# Altium project Test board - MBED.PrjPcb
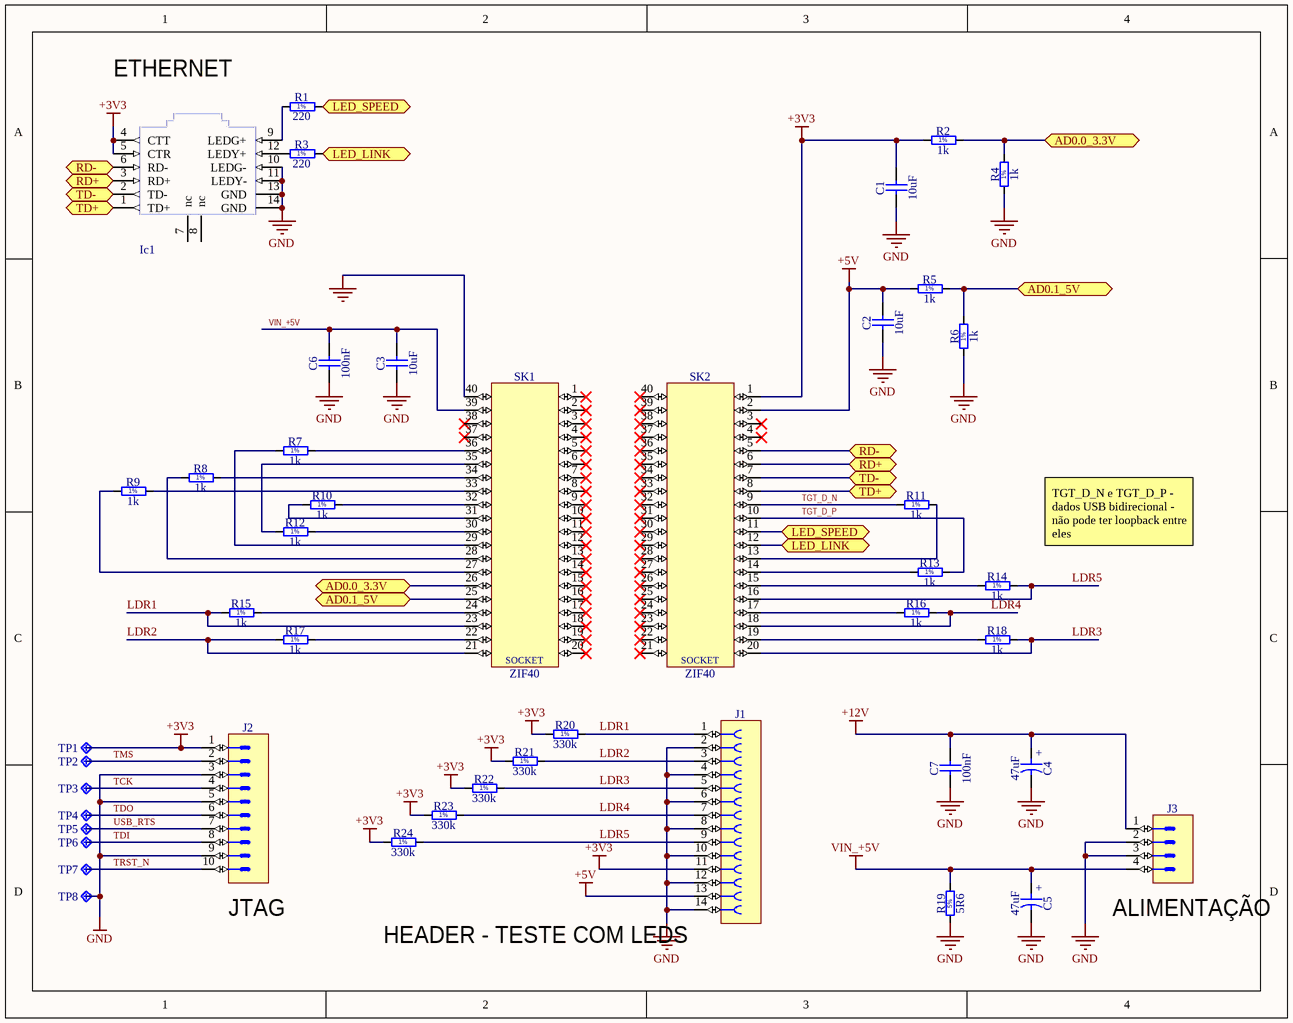
[diagram p0: test_board.schdoc]
1 sheet, 45 parts. Net scope: flat (ports and power ports of the same name join across sheets).
Board file: test_board.PcbDoc

## Sheet test_board.schdoc: AT long bus (13.3 x 4.2 inches)
size A; Organization: Organization; Address1: Address1; Address2: Address2; Address3: Address3; Address4: Address4; DocumentNumber: 1; Revision: 0; SheetNumber: 2; SheetTotal: 2

### Parts
C1  10uF  [CAPC2012X135N]
C2  10uF  [CAPC2012X135N]
C3  10uF  [CAPC2012X135N]
C4  47uF  [CAPMP3528X210N]
C5  47uF  [CAPMP3528X210N]
C6  100nF  [CAPC2012X135N]
C7  100nF  [CAPC2012X135N]
Ic1  RJ45  [J0006D21BNL]  (value not drawn)
J1  Socket 14  [SAMTEC_SSW-107-01-G-D]  (value not drawn)
J2  Header 10  [SAMTEC_FTSH-105-01-L-DV]  (value not drawn)
J3  KK®  [MOLEX_22-27-2041]  (value not drawn)
R1  220  [RESC2012X60N]
R2  1k  [RESC2012X60N]
R3  220  [RESC2012X60N]
R4  1k  [RESC2012X60N]
R5  1k  [RESC2012X60N]
R6  1k  [RESC2012X60N]
R7  1k  [RESC2012X60N]
R8  1k  [RESC2012X60N]
R9  1k  [RESC2012X60N]
R10  1k  [RESC2012X60N]
R11  1k  [RESC2012X60N]
R12  1k  [RESC2012X60N]
R13  1k  [RESC2012X60N]
R14  1k  [RESC2012X60N]
R15  1k  [RESC2012X60N]
R16  1k  [RESC2012X60N]
R17  1k  [RESC2012X60N]
R18  1k  [RESC2012X60N]
R19  5R6  [RES_WELWYN_W22]
R20  330k  [RESC2012X60N]
R21  330k  [RESC2012X60N]
R22  330k  [RESC2012X60N]
R23  330k  [RESC2012X60N]
R24  330k  [RESC2012X60N]
SK1  ZIF40  [DIPS_ZIF40]
SK2  ZIF40  [DIPS_ZIF40]
TP1  (no value)  [P25-3226]
TP2  (no value)  [P25-3226]
TP3  (no value)  [P25-3226]
TP4  (no value)  [P25-3226]
TP5  (no value)  [P25-3226]
TP6  (no value)  [P25-3226]
TP7  (no value)  [P25-3226]
TP8  (no value)  [P25-3226]

### Ports
AD0.0_3.3V, AD0.1_5V, LED_LINK, LED_SPEED, RD+, RD-, TD+, TD-

### Nets
+3V3: C1.2 Ic1.4(CTT) Ic1.5(CTR) J1.11 J2.1 R2.1 R20.1 R21.1 R22.1 R23.1 R24.1 SK2.1 TP1.H1
+5V: C2.2 J1.13 R5.1 SK2.2
+12V: C4.1 C7.2 J3.1
GND: C1.1 C2.1 C3.1 C4.2 C5.2 C6.1 C7.1 Ic1.10(LEDG-) Ic1.11(LEDY-) Ic1.13(GND) Ic1.14(GND) J1.2 J1.4 J1.6 J1.8 J1.10 J1.12 J1.14 J2.3 J2.5 J2.9 J3.2 J3.3 R4.1 R6.1 R19.1 SK1.40 TP8.H1
VIN_+5V: C3.2 C5.1 C6.2 J3.4 R19.2 SK1.39
LDR1: J1.1 R15.1 R20.2 SK1.23
LDR2: J1.3 R17.1 R21.2 SK1.21
LDR3: J1.5 R18.2 R22.2 SK2.20
LDR4: J1.7 R16.2 R23.2 SK2.18
LDR5: J1.9 R14.2 R24.2 SK2.16
TCK: J2.4 TP3.H1
TDI: J2.8 TP6.H1
TDO: J2.6 TP4.H1
TGT_D_N: R11.1 SK2.9
TGT_D_P: R13.2 SK2.10
TMS: J2.2 TP2.H1
TRST_N: J2.10 TP7.H1
USB_RTS: J2.7 TP5.H1
NetIc1_1: Ic1.1(TD+) SK2.8 ; port TD+
NetIc1_2: Ic1.2(TD-) SK2.7 ; port TD-
NetIc1_3: Ic1.3(RD+) SK2.6 ; port RD+
NetIc1_6: Ic1.6(RD-) SK2.5 ; port RD-
NetIc1_9: Ic1.9(LEDG+) R1.1
NetIc1_12: Ic1.12(LEDY+) R3.1
NetR1_2: R1.2 SK2.11 ; port LED_SPEED
NetR2_2: R2.2 R4.2 SK1.26 ; port AD0.0_3.3V
NetR3_2: R3.2 SK2.12 ; port LED_LINK
NetR5_2: R5.2 R6.2 SK1.25 ; port AD0.1_5V
NetR7_1: R7.1 SK1.29
NetR7_2: R7.2 SK1.36
NetR8_1: R8.1 SK1.28
NetR8_2: R8.2 SK1.34
NetR9_1: R9.1 SK1.27
NetR9_2: R9.2 SK1.33
NetR10_1: R10.1 SK1.31
NetR10_2: R10.2 SK1.32
NetR11_2: R11.2 SK2.13
NetR12_1: R12.1 SK1.35
NetR12_2: R12.2 SK1.30
NetR13_1: R13.1 SK2.14
NetR14_1: R14.1 SK2.15
NetR15_2: R15.2 SK1.24
NetR16_1: R16.1 SK2.17
NetR17_2: R17.2 SK1.22
NetR18_1: R18.1 SK2.19

Not connected (* = marked no-connect by the designer): Ic1 7(nc) 8(nc); SK1 1* 2* 3* 4* 5* 6* 7* 8* 9* 10* 11* 12* 13* 14* 15* 16* 17* 18* 19* 20* 37* 38*; SK2 3* 4* 21* 22* 23* 24* 25* 26* 27* 28* 29* 30* 31* 32* 33* 34* 35* 36* 37* 38* 39* 40*

### Notes on the sheet
- ETHERNET
- (near R14) TGT_D_N e TGT_D_P - dados USB bidirecional - não pode ter loopback entre eles
- (near J2) JTAG
- HEADER - TESTE COM LEDS
- (near J3) ALIMENTAÇÃO
- (in symbol 240-1280-00-0602J) SOCKET
- (in symbol CTE3528-21_47UF_6.3V_10%_LESR0250) +
- (in symbol R0805_1K_1%_0.125W_100PPM) 1%
- (in symbol R0805_220R_1%_0.125W_100PPM) 1%
- (in symbol R0805_330K_1%_0.125W_100PPM) 1%
- (in symbol RWW_5R6_5%_7W_75PPM_WELWYN_W22) 5%

### Library data of the parts
C1-C3 = CC0805_10UF_10V_10%_X7R: Non-polarised capacitor; Part Description: SMD Multilayer Chip Ceramic Capacitor; Manufacturer: GENERIC; Manufacturer1 Part Number: GRM21BR71A106KE51L; Voltage: 10V; TC: X7R; Tolerance: ±10%; Part Number: CC0805_10UF_10V_10%_X7R; Component Kind: Standard; Component Type: Standard; Pin Count: 2; Value: 10uF; Status: Preferred; Manufacturer Part Number: CC0805_10UF_10V_10%_X7R; Case: 0805; Mounted: Yes; Socket: No; SMD: Yes; Sense: No; Manufacturer1 Example: MURATA; Manufacturer1 ComponentHeight: 1.35mm; HelpURL: \\cern.ch\dfs\Applications\Altium\Datasheets\CC0805_X7R_MURATA.pdf; Author: CERN DEM JLC; CreateDate: 30/04/2012; LatestRevisionDate: 30/04/2012
C4 C5 = CTE3528-21_47UF_6.3V_10%_LESR0250: Polarised capacitor; Part Description: Low ESR 0R25 Solid Tantalum Chip Capacitor; Manufacturer: GENERIC; Manufacturer1 Part Number: TPSB476K006R0250; Voltage: 6.3V; Tolerance: ±10%; Part Number: CTE3528-21_47UF_6.3V_10%_LESR0250; Component Kind: Standard; Component Type: Standard; Pin Count: 2; Value: 47uF; Status: Preferred; Manufacturer Part Number: CTE3528-21_47UF_6.3V_10%_LESR0250; Case: B; Mounted: Yes; Socket: No; SMD: Yes; Sense: No; Manufacturer1 Example: AVX; Manufacturer1 ComponentHeight: 2.1mm; HelpURL: \\cern.ch\dfs\Applications\Altium\Datasheets\CTE-LESR_AVX_TPS.pdf; Author: CERN DEM JLC; CreateDate: 05/05/2008; LatestRevisionDate: 20/01/2009
C6 C7 = CC0805_100NF_50V_10%_X7R: Non-polarised capacitor; Part Description: SMD Multilayer Chip Ceramic Capacitor; Manufacturer: GENERIC; Manufacturer1 Part Number: C2012X7R1H104K085AA; Voltage: 50V; TC: X7R; Tolerance: ±10%; Part Number: CC0805_100NF_50V_10%_X7R; Component Kind: Standard; Component Type: Standard; Pin Count: 2; Value: 100nF; Status: Preferred; Manufacturer Part Number: CC0805_100NF_50V_10%_X7R; Case: 0805; Mounted: Yes; Socket: No; SMD: Yes; Sense: No; Manufacturer1 Example: TDK; Manufacturer1 ComponentHeight: 1mm; HelpURL: \\cern.ch\dfs\Applications\Altium\Datasheets\CC0805_X7R_TDK_C.pdf; Author: CERN DEM JLC; CreateDate: 03/12/2007; LatestRevisionDate: 22/04/2015
Ic1 = J0006D21BNL: CONN MAGJACK 1PORT 100 BASE-TX; Manufacturer: Pulse Electronics Corporation; Part Description: 1 Port, 1x1 Tab-Down 10/100BASE-TX RJ45 FastJack Connector Module With LEDs Y/G; Number of Ports: 1; LED Color: Green - Yellow; Number of Cores per Jack: 4; Shielding: Shielded; Tab Direction: Down; Shield Material: Brass; PressFit: No; Supplier 1: Digi-Key; Manufacturer Part Number: J0006D21BNL; RoHS: RoHS Compliant; Category: Connectors, Interconnects; Stock 1: 1565; Pricing 1: 1=6.38, 25=5.586, 50=5.32, 100=5.054, 250=4.522, 500=4.256, 1000=3.724, 2500=3.5378, 5000=3.458 (USD); Packaging: Bulk; Connector Type: RJ45; Number of Rows: 1; Applications: 10/100 Base-TX, AutoMDIX; Mounting Type: Through Hole; Orientation: 90° Angle (Right); Termination: Solder; Height Above Board: 0.545" (13.84mm); Features: Board Guide; Contact Material: Phosphor Bronze; Contact Finish: Gold; Contact Finish Thickness: 15µin (0.38µm); Housing Material: Thermoplastic; Operating Temperature: 0°C ~ 70°C; ComponentLink1URL: http://productfinder.pulseeng.com/products/datasheets/J403.pdf; ComponentLink1Description: http://productfinder.pulseeng.com/products/datasheets/J403.pdf; Supplier Part Number 1: J0006D21BNL; Part Number: J0006D21BNL; Component Kind: Standard; Component Type: Standard; Pin Count: 16; Family: RJ45; Mounted: Yes; Socket: No; SMD: No; Sense: No; Status: None; ComponentHeight: 13.84mm; HelpURL: http://productfinder.pulseeng.com/products/datasheets/J403.pdf; Author: LNLS DIG FCS; CreateDate: 28/06/2016; LatestRevisionDate: 28/06/2016
J1 = SAMTEC_SSW-107-01-G-D: Connector 14 Female; Part Description: 14 Contacts - Pitch 2.54mm - Double Row Through Mount Straight Socket (Lead Length 2.64mm); Manufacturer: SAMTEC; PressFit: No; Part Number: SAMTEC_SSW-107-01-G-D; Component Kind: Standard; Component Type: Standard; Pin Count: 14; Family: Socket 14; Mounted: Yes; Socket: No; Sense: No; SMD: No; Status: None; Manufacturer Part Number: SSW-107-01-G-D; ComponentHeight: 8.51mm; HelpURL: \\cern.ch\dfs\Applications\Altium\Datasheets\SAMTEC_SSW-107-01-G-D.pdf; Author: CERN DEM MR; CreateDate: 10/03/2016; LatestRevisionDate: 10/03/2016
J2 = SAMTEC_FTSH-105-01-L-DV: Connector 10 Male; Part Description: 10 Contacts, Pitch 1.27mm, Dual Row SMT Micro Header; Manufacturer: SAMTEC; PressFit: No; Part Number: SAMTEC_FTSH-105-01-L-DV; Component Kind: Standard; Component Type: Standard; Pin Count: 10; Family: Header 10; Mounted: Yes; Socket: No; Sense: No; SMD: Yes; Status: None; Manufacturer Part Number: FTSH-105-01-L-DV; ComponentHeight: 8.1mm; Author: LNLS DIG LOS; CreateDate: 17/11/2017; LatestRevisionDate: 17/11/2017
J3 = MOLEX_22-27-2041: Connector 4 Male; Part Description: 2.54mm (.100") Pitch KK® Wire-to-Board Header, Vertical, with Friction Lock, 4 Circuits, Tin (Sn) Plating; Manufacturer: MOLEX; PressFit: No; Part Number: MOLEX_22-27-2041; Component Kind: Standard; Component Type: Standard; Pin Count: 4; Family: KK®; Mounted: Yes; Socket: No; SMD: No; Sense: No; Status: None; Manufacturer Part Number: 22-27-2041; ComponentHeight: 11.7mm; HelpURL: \\cern.ch\dfs\Applications\Altium\Datasheets\MOLEX_22-27-2041.pdf; Author: CERN DEM JLC; CreateDate: 04/12/2008; LatestRevisionDate: 04/12/2008
R1 R3 = R0805_220R_1%_0.125W_100PPM: Resistor - 1%; Manufacturer: GENERIC; Part Description: General Purpose Thick Film Chip Resistor; Manufacturer1 Part Number: NRC10F2200TRF; Power: 0.125W; TC: ±100ppm/°C; Manufacturer Part Number: R0805_220R_1%_0.125W_100PPM; Tolerance: ±1%; Part Number: R0805_220R_1%_0.125W_100PPM; Component Kind: Standard; Component Type: Standard; Pin Count: 2; Value: 220; Status: Preferred; Case: 0805; Mounted: Yes; Sense: No; Socket: No; SMD: Yes; Manufacturer1 Example: NIC COMPONENT; Manufacturer1 ComponentHeight: 0.6mm; HelpURL: \\cern.ch\dfs\Applications\Altium\Datasheets\R0805_NIC_NRC.pdf; Author: CERN DEM JLC; CreateDate: 03/12/2007; LatestRevisionDate: 13/03/2008
R2 R4-R18 = R0805_1K_1%_0.125W_100PPM: Resistor - 1%; Part Description: General Purpose Thick Film Chip Resistor; Manufacturer: GENERIC; Manufacturer1 Part Number: NRC10F1001TRF; Power: 0.125W; TC: ±100ppm/°C; Part Number: R0805_1K_1%_0.125W_100PPM; Component Kind: Standard; Component Type: Standard; Pin Count: 2; Value: 1k; Status: Preferred; Tolerance: ±1%; Manufacturer Part Number: R0805_1K_1%_0.125W_100PPM; Case: 0805; Mounted: Yes; Sense: No; Socket: No; SMD: Yes; Manufacturer1 Example: NIC COMPONENT; Manufacturer1 ComponentHeight: 0.6mm; HelpURL: \\cern.ch\dfs\Applications\Altium\Datasheets\R0805_NIC_NRC.pdf; Author: CERN DEM JLC; CreateDate: 03/12/2007; LatestRevisionDate: 13/03/2008
R19 = RWW_5R6_5%_7W_75PPM_WELWYN_W22: Resistor - 5%; Part Description: Vitreous Enamelled Wirewound Resistor; Manufacturer: TT WELWYN; Manufacturer Part Number: W22-5R6JI; Power: 7W; TC: ±75ppm/°C; Part Number: RWW_5R6_5%_7W_75PPM_WELWYN_W22; Component Kind: Standard; Component Type: Standard; Pin Count: 2; Value: 5R6; Status: None; Tolerance: ±5%; Case: LS30.48 L22 x D8; Mounted: Yes; Sense: No; Socket: No; SMD: No; ComponentHeight: 8mm; HelpURL: \\cern.ch\dfs\Applications\Altium\Datasheets\RWW_WELWYN_W22.pdf; Author: CERN DEM JLC; CreateDate: 29/05/2013; LatestRevisionDate: 29/05/2013
R20-R24 = R0805_330K_1%_0.125W_100PPM: Resistor - 1%; Part Description: General Purpose Thick Film Chip Resistor; Manufacturer: GENERIC; Manufacturer1 Part Number: NRC10F3303TRF; Power: 0.125W; TC: ±100ppm/°C; Part Number: R0805_330K_1%_0.125W_100PPM; Component Kind: Standard; Component Type: Standard; Pin Count: 2; Value: 330k; Status: Preferred; Tolerance: ±1%; Manufacturer Part Number: R0805_330K_1%_0.125W_100PPM; Case: 0805; Mounted: Yes; Sense: No; Socket: No; SMD: Yes; Manufacturer1 Example: NIC COMPONENT; Manufacturer1 ComponentHeight: 0.6mm; HelpURL: \\cern.ch\dfs\Applications\Altium\Datasheets\R0805_NIC_NRC.pdf; Author: CERN DEM JLC; CreateDate: 03/12/2007; LatestRevisionDate: 13/03/2008
SK1 SK2 = 240-1280-00-0602J: DIL Socket 40 Leads; Part Description: Connector IC DIP Socket ZIF 40POS, Row Spacing 15.24 mm; Pitch 2.54 mm; Manufacturer: 3M; Part Number: 240-1280-00-0602J; Component Kind: Standard; Component Type: Standard; Pin Count: 40; PackageDescription: DIP Socket ZIF 40 Leads, Row Spacing 15.24mm; Pitch 2.54mm; Mounted: Yes; Socket: No; SMD: No; PressFit: Yes; Sense: No; Device: ZIF40; Manufacturer Part Number: 240-1280-00-0602J; ComponentHeight: 11.9mm; Author: LNLS DIG LOS; CreateDate: 19/02/2018; LatestRevisionDate: 19/02/2018
TP1-TP8 = HARWIN_P25-3226: Probe 2.54mm Crown; Part Description: Probe For 2.54mm Pitch, Serrated Head; Manufacturer: HARWIN; PressFit: No; Part Number: HARWIN_P25-3226; Component Kind: Standard; Component Type: Standard; Pin Count: 1; Mounted: Yes; Socket: No; SMD: No; Sense: No; Status: None; Manufacturer Part Number: P25-3226; ComponentHeight: 33.3mm; Author: LNLS DIG LOS; CreateDate: 02/03/2018; LatestRevisionDate: 05/03/2018